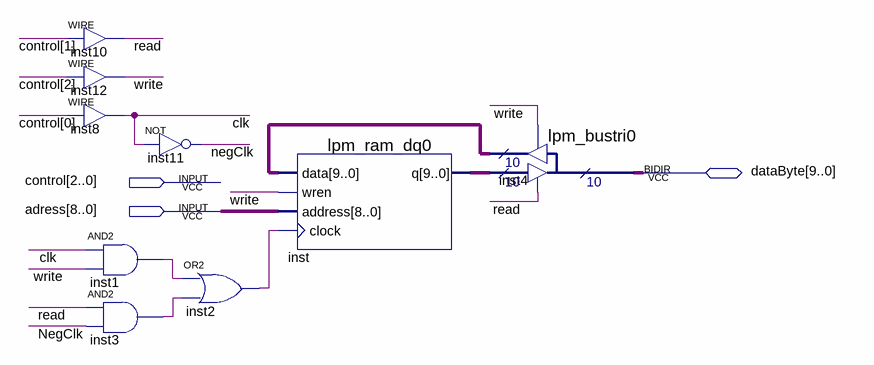
[diagram p0: schematic sheet]
// Quartus schematic Ram.bdf as structural Verilog: 9 symbols, 3 pins
module Ram (
  input  [2:0] control,
  input  [8:0] adress,
  inout  [9:0] dataByte
);

  wire clk, inst1_out, inst2_out, inst3_out, negClk, read, write;
  wire [9:0] inst4_result, inst_q;

  assign read = control[1];  // WIRE inst10
  assign write = control[2];  // WIRE inst12
  assign clk = control[0];  // WIRE inst8
  not inst11 (negClk, clk);
  and inst1 (inst1_out, clk, write);
  and inst3 (inst3_out, read, negClk);
  or inst2 (inst2_out, inst1_out, inst3_out);
  lpm_ram_dq0 inst (.data(inst4_result), .wren(write), .address(adress), .clock(inst2_out), .q(inst_q));
  lpm_bustri0 inst4 (.enabledt(read), .data(inst_q), .enabletr(write), .result(inst4_result), .tridata(dataByte));
endmodule
